# EasyEDA Pro project CH32V307_V6.0.0.eprj, board CH32V307
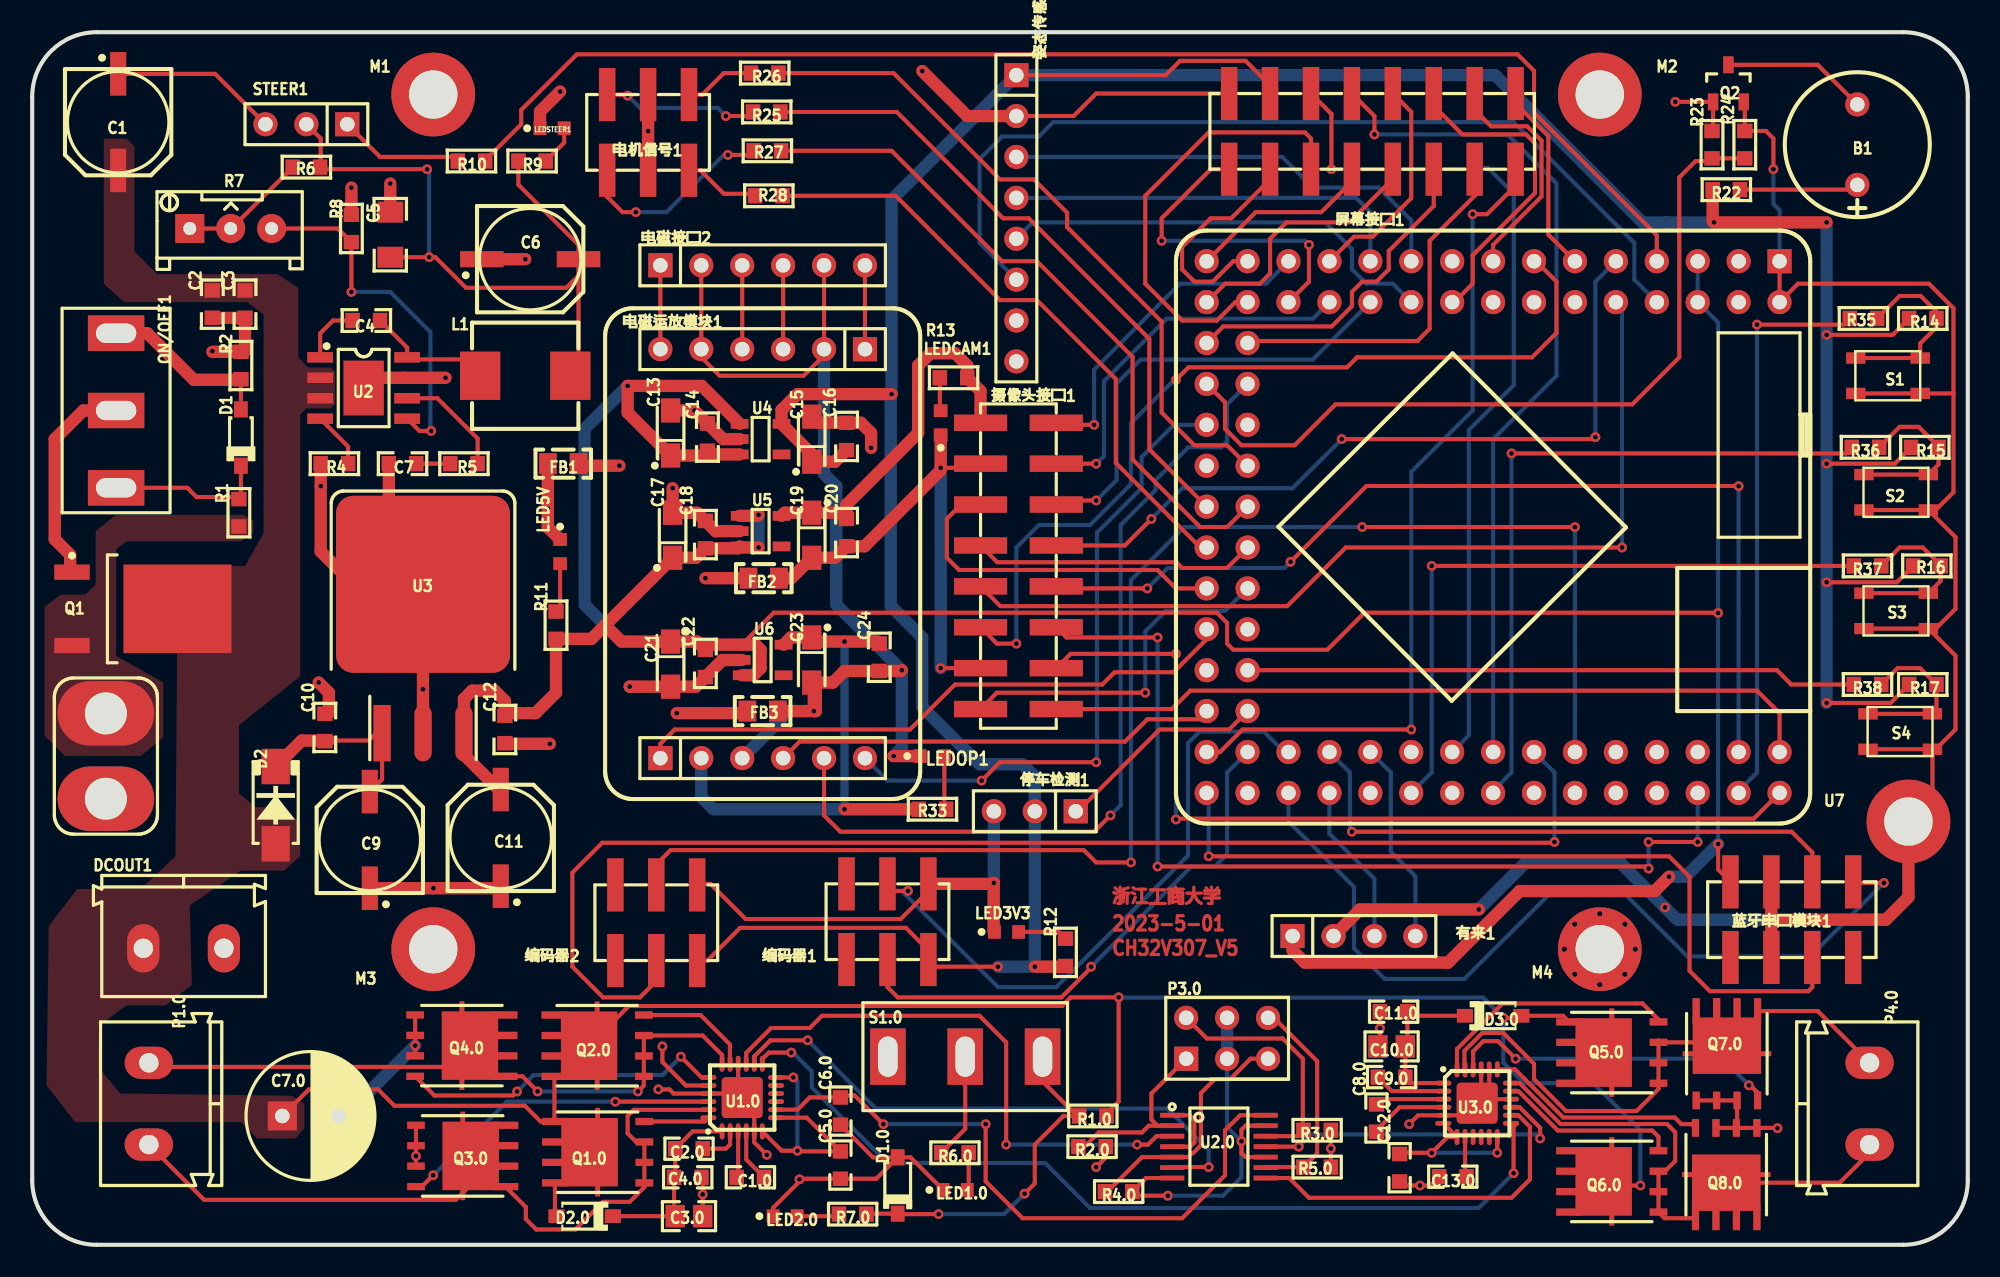
[diagram p1: board, top side]
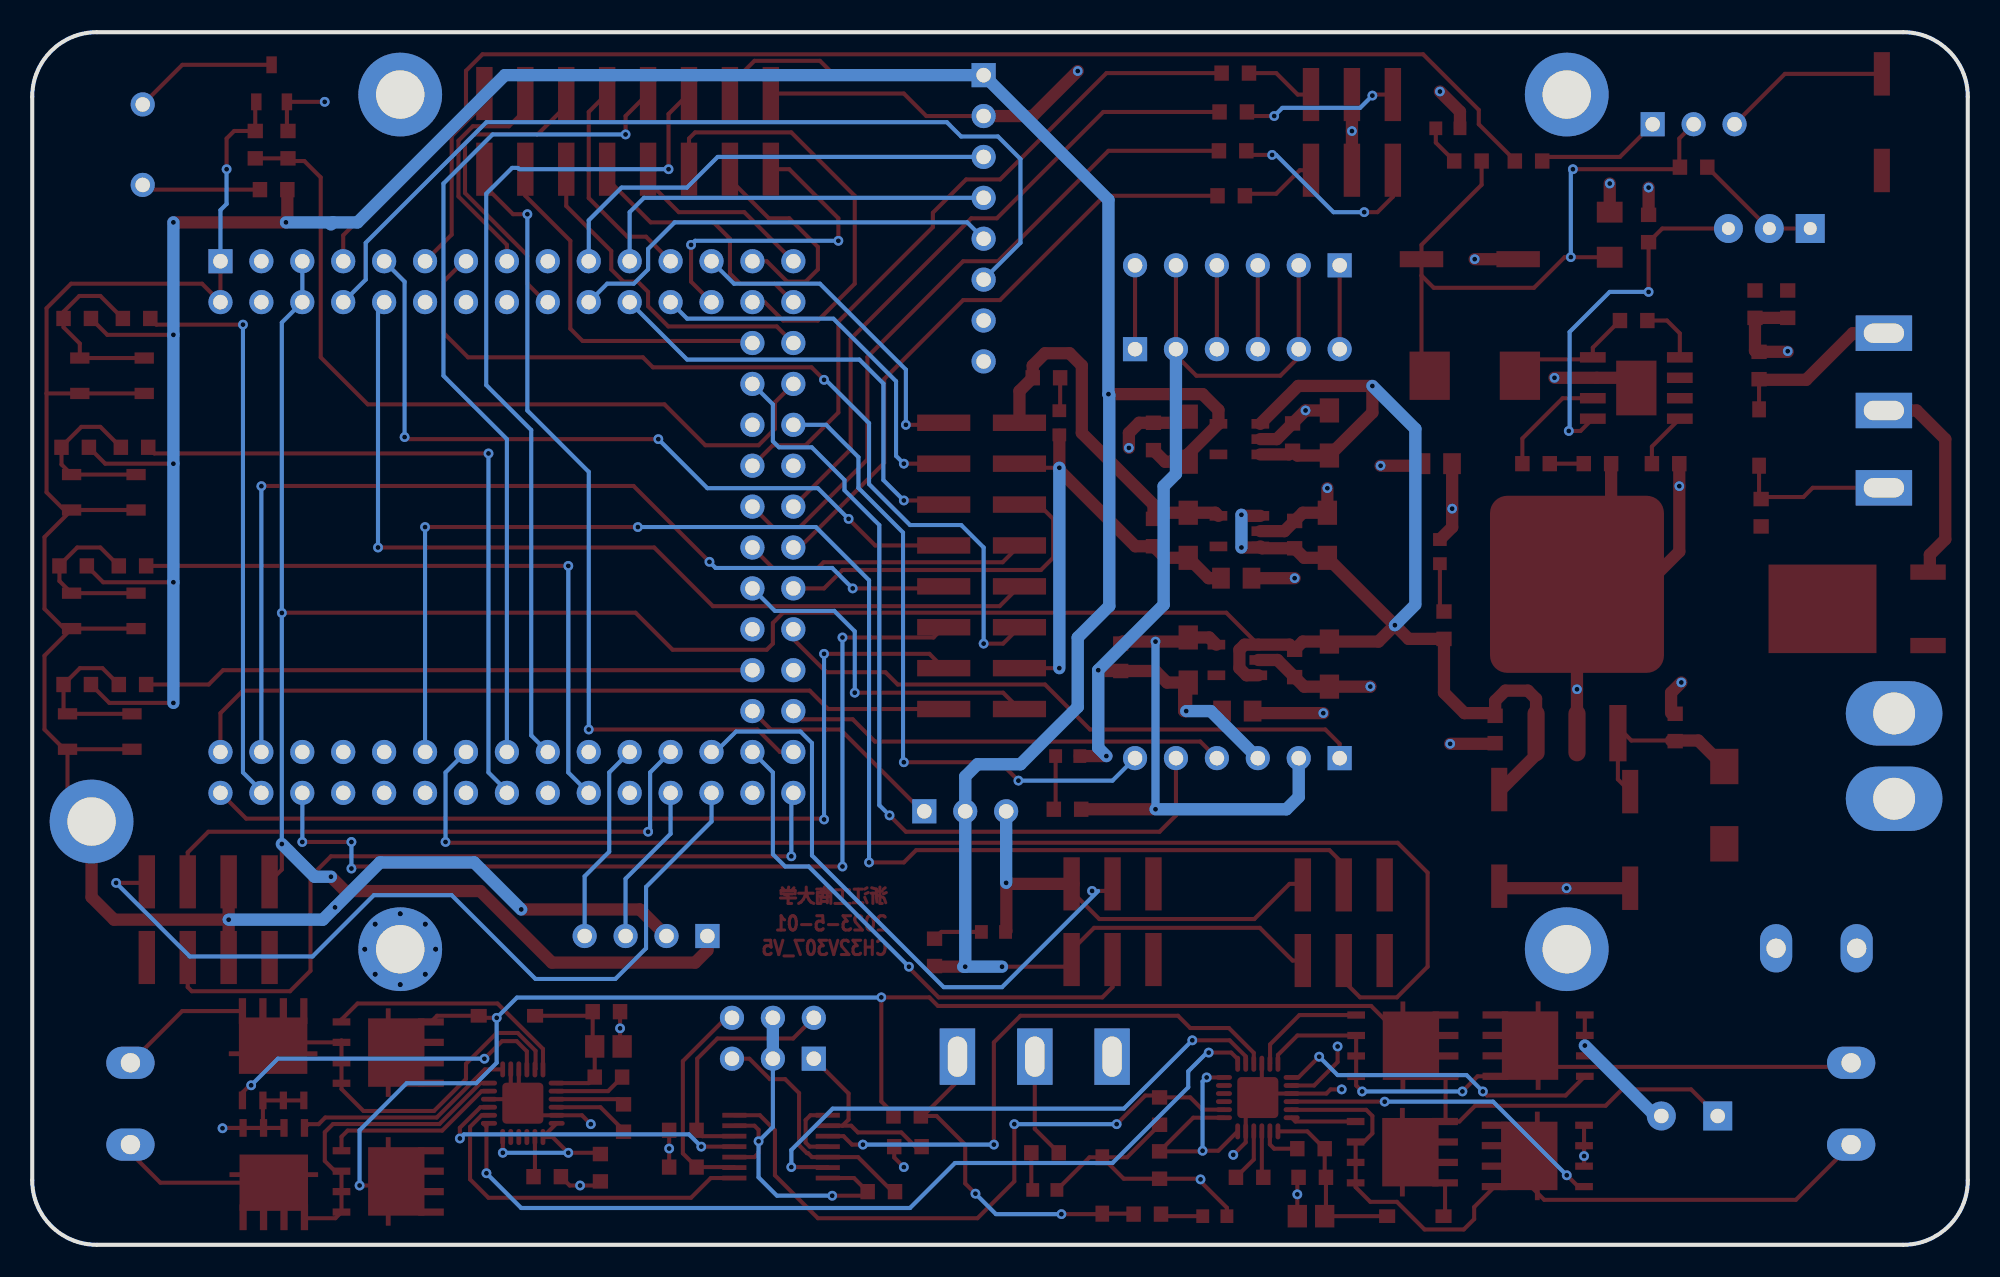
[diagram p2: board, bottom side, seen from below]

Outline 120.14 x 75.31 mm; copper layers: Top Layer, Bottom Layer. Coordinates in mm from the lower left corner of the outline.
Outline path: 0,71.31 0,4 arc(1.17,1.17) 4,0 116.14,0 arc(118.97,1.17) 120.14,4 120.14,71.31 arc(118.97,74.14) 116.14,75.31 4,75.31 arc(1.17,74.14) 0,71.31
Stack: Top Layer 0.035mm / Dielectric1 1.51mm FR4 er 4.5 / Bottom Layer 0.035mm

## Design rules (mm)
spacing safeClearance (default): track to track 0.152, other pairs 0.152 to 0.3
track width trackWidth (default): min 0.127, default 0.254, max 2.54
differential pair differentialPair (default): width min 0.127, default 0.254, max 2.54; gap min 0.152, default 0.152
via viaSize (default): diameter min 0.5, default 0.61, max 10; hole min 0.3, default 0.305, max 6

## Placement (name value [footprint] x y rotation side)
B1  BEEP  [BEEP 9x5.5mm]  113.28 68.33 90 top
C1  220uF  [CAPS6.3]  5.33 69.72 90 top
C1.0  100nF  [CAPC1608[0603]S-N]  44.58 4.19 180 top
C2  4.7nF  [CAPC1608[0603]S-N]  11.18 58.42 270 top
C2.0  1uF  [CAPC1608[0603]S-N]  40.77 5.97 180 top
C3  100nF  [CAPC1608[0603]S-N]  13.21 58.42 270 top
C3.0  10uF  [CAPC2012[0805]S-N]  40.77 1.78 0 top
C4  100nF  [CAPC1608[0603]S-N]  20.74 57.4 0 top
C4.0  100nF  [CAPC1608[0603]S-N]  40.69 4.19 0 top
C5  47uF  [CAPC3216[1206]S]  22.22 62.74 90 top
C5.0  1uF  [CAPC1608[0603]S-N]  50.17 4.95 90 top
C6  220uF  [CAPS6.3]  30.91 61.21 180 top
C6.0  1uF  [CAPC1608[0603]S-N]  50.17 8.3 90 top
C7  4.7nF  [CAPC1608[0603]S-N]  22.99 48.51 180 top
C7.0  220uF  [CAPPR3.5-8X11.5]  17.27 8 0 top
C8.0  100nF  [CAPC1608[0603]S-N]  83.44 7.87 90 top
C9  100uF  [CAPS6.3]  20.95 25.15 270 top
C9.0  1uF  [CAPC1608[0603]S-N]  84.38 10.41 0 top
C10  100nF  [CAPC1608[0603]S-N]  18.16 32.13 90 top
C10.0  10uF  [CAPC2012[0805]S-N]  84.38 12.32 180 top
C11  220uF  [CAPS6.3]  29.08 25.27 270 top
C11.0  100nF  [CAPC1608[0603]S-N]  84.5 14.48 180 top
C12  100nF  [CAPC1608[0603]S-N]  29.34 32 270 top
C12.0  1uF  [CAPC1608[0603]S-N]  84.87 4.79 90 top
C13  10uF  [CAPT3216]  39.62 50.42 90 top
C13.0  1uF  [CAPC1608[0603]S-N]  88.18 4.23 0 top
C14  100nF  [CAPC1608[0603]S-N]  41.91 50.17 90 top
C15  10uF  [CAPT3216]  48.39 50.04 90 top
C16  100nF  [CAPC1608[0603]S-N]  50.55 50.2 90 top
C17  10uF  [CAPT3216]  39.75 44.07 90 top
C18  100nF  [CAPC1608[0603]S-N]  41.78 44.11 90 top
C19  10uF  [CAPT3216]  48.39 44.07 270 top
C20  100nF  [CAPC1608[0603]S-N]  50.55 44.24 270 top
C21  10uF  [CAPT3216]  39.62 36.07 270 top
C22  100nF  [CAPC1608[0603]S-N]  41.78 36.11 270 top
C23  10uF  [CAPT3216]  48.39 36.32 270 top
C24  100nF  [CAPC1608[0603]S-N]  52.58 36.49 270 top
D1  BZT52C16  [SOD-123-L]  12.95 50.14 270 top
D1.0  BZT52C3V3  [SOD-123-L]  53.72 3.68 270 top
D2  SS54  [SMA[DO-214AC]]  15.11 27.31 90 top
D2.0  1N5819  [SOD-123-L]  34.29 1.78 0 top
D3.0  1N5819  [SOD-123-L]  90.68 14.22 180 top
DCOUT1  KF/WJ/DG 30x connecter  [KF/WJ/DG 301-2p-5.0mm#2]  9.4 18.42 0 top
FB1  0R  [INDC2012[0805]S]  32.96 48.51 0 top
FB2  0R  [INDC2012[0805]S]  45.41 41.4 0 top
FB3  0R  [INDC2012[0805]S]  45.34 33.15 0 top
L1  4.7uH  [0630 TPC 7*7*3]  30.6 53.98 0 top
LED1.0  Blue  [LEDC1608(0603)]  57.29 3.41 0 top
LED2.0  RED  [LEDC1608(0603)]  46.74 1.78 0 top
LED3V3  翠绿贴片LED  [LEDC1608(0603)]  60.48 19.43 0 top
LED5V  翠绿贴片LED  [LEDC1608(0603)]  32.77 43.05 270 top
LEDCAM1  翠绿贴片LED  [LEDC1608(0603)]  56.39 51.05 90 top
LEDOP1  翠绿贴片LED  [LEDC1608(0603)]  55.87 30.35 0 top
LEDSTEER1  翠绿贴片LED  [LEDC1608(0603)]  32.27 69.34 0 top
M1  MountHole  [M3-MountHole-Plated]  24.89 71.44 0 top
M2  MountHole  [M3-MountHole-Plated]  97.3 71.44 0 top
M3  MountHole  [M3-MountHole-Plated]  24.89 18.36 0 top
M4  MountHole  [M3-MountHole-Plated]  97.3 18.36 0 top
NOREF  -  [Pad_e1205]  116.46 26.29 0 top
ON/OFF1  SW-SPDT  [SS12D10]  5.21 51.82 90 top
P1.0  KF/WJ/DG 30x connecter  [KF/WJ/DG 301-2p-5.0mm]  7.24 8.76 270 top
P3.0  Header 3X2  [HDR2X3]  71.63 11.56 0 top
P4.0  KF/WJ/DG 30x connecter  [KF/WJ/DG 301-2p-5.0mm]  114.05 8.76 90 top
Q1  HY19P03  [TO-252AA]  5.74 39.5 0 top
Q1.0  TPH1R403NL  [DFN5x6]  35.1 5.75 90 top
Q2  S8050  [SOT-23]  105.28 72.14 90 top
Q2.0  TPH1R403NL  [DFN5x6]  35.06 12.36 90 top
Q3.0  TPH1R403NL  [DFN5x6]  26.72 5.52 270 top
Q4.0  TPH1R403NL  [DFN5x6]  26.67 12.37 270 top
Q5.0  TPH1R403NL  [DFN5x6]  98.04 11.94 90 top
Q6.0  TPH1R403NL  [DFN5x6]  98.04 3.94 90 top
Q7.0  TPH1R403NL  [DFN5x6]  105.19 11.87 0 top
Q8.0  TPH1R403NL  [DFN5x6]  105.15 4.36 180 top
R1  4.7K  [RESC1608[0603]S-N]  12.83 45.47 90 top
R1.0  2.2K  [RESC1608[0603]S-N]  65.83 8 180 top
R2  1K  [RESC1608[0603]S-N]  12.95 54.61 270 top
R2.0  10K  [RESC1608[0603]S-N]  65.79 6.1 0 top
R3.0  10K  [RESC1608[0603]S-N]  79.76 7.11 180 top
R4  200K  [RESC1608[0603]S-N]  18.76 48.51 180 top
R4.0  10K  [RESC1608[0603]S-N]  67.44 3.3 0 top
R5  20K  [RESC1608[0603]S-N]  26.8 48.51 180 top
R5.0  10K  [RESC1608[0603]S-N]  79.76 4.83 180 top
R6  15K  [RESC1608[0603]S-N]  17.02 66.93 180 top
R6.0  330R  [RESC1608[0603]S-N]  57.28 5.72 0 top
R7  10K  [RESPOT3296]  12.32 63.12 0 top
R7.0  1K  [RESC1608[0603]S-N]  50.93 1.91 180 top
R8  3.3K  [RESC1608[0603]S-N]  19.81 63.12 90 top
R9  10K  [RESC1608[0603]S-N]  31.03 67.31 180 top
R10  1K  [RESC1608[0603]S-N]  27.27 67.31 0 top
R11  4.7K  [RESC1608[0603]S-N]  32.51 38.48 90 top
R12  2.7K  [RESC1608[0603]S-N]  64.14 18.16 90 top
R13  2.7K  [RESC1608[0603]S-N]  57.19 53.85 180 top
R14  4.7K(DNP)  [RESC1608[0603]S-N]  117.35 57.53 0 top
R15  4.7K(DNP)  [RESC1608[0603]S-N]  117.48 49.53 0 top
R16  4.7K(DNP)  [RESC1608[0603]S-N]  117.6 42.16 0 top
R17  4.7K(DNP)  [RESC1608[0603]S-N]  117.35 34.8 0 top
R22  10R  [RESC1608[0603]S-N]  105.16 65.53 0 top
R23  4.7K  [RESC1608[0603]S-N]  104.27 68.33 90 top
R24  10K  [RESC1608[0603]S-N]  106.3 68.33 90 top
R25  100R  [RESC1608[0603]S-N]  45.59 70.36 0 top
R26  100R  [RESC1608[0603]S-N]  45.47 72.77 0 top
R27  100R  [RESC1608[0603]S-N]  45.63 67.95 0 top
R28  100R  [RESC1608[0603]S-N]  45.72 65.15 0 top
R33  2.7K  [RESC1608[0603]S-N]  55.88 27.05 0 top
R35  470R  [RESC1608[0603]S-N]  113.67 57.53 180 top
R36  470R  [RESC1608[0603]S-N]  113.79 49.53 180 top
R37  470R  [RESC1608[0603]S-N]  113.92 42.16 180 top
R38  470R  [RESC1608[0603]S-N]  113.92 34.8 180 top
S1  Button  [PTS810-3*4-CurvePin]  115.19 53.98 0 top
S1.0  SW-SPDT  [SS12D10]  57.91 11.68 0 top
S2  Button  [PTS810-3*4-CurvePin]  115.7 46.74 0 top
S3  Button  [PTS810-3*4-CurvePin]  115.7 39.37 0 top
S4  Button  [PTS810-3*4-CurvePin]  115.95 31.88 0 top
STEER1  Header 3  [HDR1X3]  19.56 69.6 180 top
U1  T型插头  [Wired T-Header ThroughHole]  4.57 30.35 0 top
U1.0  DRV8701E  [QFN24-4x4]  44.07 9.14 90 top
U2  SCT2450  [SOP-8E]  20.57 53.21 0 top
U2.0  SN74HC125PWR  [TSSOP-14]  73.66 6.1 0 top
U3  SPX2940-5.0  [TO-263-3]  24.26 36.4 0 top
U3.0  DRV8701E  [QFN24-4x4]  89.69 8.79 0 top
U4  RT9013-33  [SOT-23-5]  45.21 50.04 0 top
U5  RT9013-33  [SOT-23-5]  45.21 44.32 0 top
U6  RT9013-33  [SOT-23-5]  45.34 36.32 0 top
U7  -  [CH32V307VxT6_CoreBoard]  108.46 61.09 180 top
停车检测1  Header 3  [HDR1X3]  64.77 26.92 180 top
姿态传感器1  Header 8  [HDR1X8]  61.09 72.64 270 top
屏幕接口1  Header 8X2  [HDR2X8-M-SMT]  83.18 69.15 0 top
摄像头接口1  Header 8X2  [HDR2X8-M-SMT]  61.21 42.16 90 top
有来1  Header 4  [HDR1X4]  78.23 19.18 0 top
电机信号1  Header 3X2  [HDR2X3-M-SMT]  38.23 69.09 180 top
电磁接口2  Header 6  [HDR1X6]  38.99 60.83 0 top
电磁运放模块1  OPA_MOD  [SEEKFREE_4CHANEL_OPAMOD]  45.34 42.93 0 top
编码器1  Header 3X2  [HDR2X3-M-SMT]  53.09 20.07 180 top
编码器2  Header 3X2  [HDR2X3-M-SMT]  38.73 20 180 top
蓝牙串口模块1  Header 4X2  [Female-Header-2.54-SMD-8]  109.22 20.19 270 top

## Footprints (pads in the part's own frame, mm; a bottom-side part is the same pattern mirrored in y, then rotated)
0630 TPC 7*7*3
  rect 2.5x3 smd: 1(-2.8,0) 2(2.8,0)
BEEP 9x5.5mm
  round 1.5 hole 0.9: 1(-2.5,0) 2(2.5,0)
CAPC1608[0603]S-N
  rect 0.9x0.95 smd: 1(-0.85,0) 2(0.85,0)
CAPC2012[0805]S-N
  rect 1.2x1.4 smd: 1(-0.85,0) 2(0.85,0)
CAPC3216[1206]S
  rect 1.3x1.6 smd: 1(-1.4,0) 2(1.4,0)
CAPPR3.5-8X11.5
  rect 1.8x1.8 hole 0.9: 1(-1.75,0)
  round 1.8 hole 0.9: 2(1.75,0)
CAPS6.3
  rect 2.7x1 smd: 1(-3,0) 2(3,0)
CAPT3216
  rect 1.5x1.2 smd: 1(-1.4,0) 2(1.4,0)
CH32V307VxT6_CoreBoard
  rect 1.5x1.5 hole 0.9: 1(0,0)
  round 1.5 hole 0.9: 2(0,2.54) 3(2.54,0) 4(2.54,2.54) 5(5.08,0) 6(5.08,2.54) 7(7.62,0) 8(7.62,2.54) 9(10.16,0) 10(10.16,2.54) 11(12.7,0) 12(12.7,2.54) 13(15.24,0) 14(15.24,2.54) 15(17.78,0) 16(17.78,2.54) 17(20.32,0) 18(20.32,2.54) 19(22.86,0) 20(22.86,2.54) 21(25.4,0) 22(25.4,2.54) 23(27.94,0) 24(27.94,2.54) 25(30.48,0) 26(30.48,2.54) 27(33.02,0) 28(33.02,2.54) 29(35.56,0) 30(35.56,2.54) 31(35.56,5.08) 32(33.02,5.08) 33(35.56,7.62) 34(33.02,7.62) 35(35.56,10.16) 36(33.02,10.16) 37(35.56,12.7) 38(33.02,12.7) 39(35.56,15.24) 40(33.02,15.24) 41(35.56,17.78) 42(33.02,17.78) 43(35.56,20.32) 44(33.02,20.32) 45(35.56,22.86) 46(33.02,22.86) 47(35.56,25.4) 48(33.02,25.4) 49(35.56,27.94) 50(33.02,27.94) 51(35.56,33.02) 52(35.56,30.48) 53(33.02,33.02) 54(33.02,30.48) 55(30.48,33.02) 56(30.48,30.48) 57(27.94,33.02) 58(27.94,30.48) 59(25.4,33.02) 60(25.4,30.48) 61(22.86,33.02) 62(22.86,30.48) 63(20.32,33.02) 64(20.32,30.48) 65(17.78,33.02) 66(17.78,30.48) 67(15.24,33.02) 68(15.24,30.48) 69(12.7,33.02) 70(12.7,30.48) 71(10.16,33.02) 72(10.16,30.48) 73(7.62,33.02) 74(7.62,30.48) 75(5.08,33.02) 76(5.08,30.48) 77(2.54,33.02) 78(2.54,30.48) 79(0,33.02) 80(0,30.48)
DFN5x6
  rect 0.45x1.6 smd: 1(-1.905,2.65) 1(-0.635,2.65) 1(0.635,2.65) 1(1.905,2.65)
  rect 4.25x3.5 smd: 1(0,0.5)
  rect 5.5x0.3 smd: 1(0,0)
  rect 0.45x1.1 smd: 2(1.905,-2.9) 3(-1.905,-2.9) 3(-0.635,-2.9) 3(0.635,-2.9)
Female-Header-2.54-SMD-8
  rect 3.3x1.02 smd: 1(-2.35,3.81) 2(2.35,3.81) 3(-2.35,1.27) 4(2.35,1.27) 5(-2.35,-1.27) 6(2.35,-1.27) 7(-2.35,-3.81) 8(2.35,-3.81)
HDR1X3
  rect 1.5x1.5 hole 0.9: 1(0,0)
  round 1.5 hole 0.9: 2(2.54,0) 3(5.08,0)
HDR1X4
  rect 1.5x1.5 hole 0.9: 1(0,0)
  round 1.5 hole 0.9: 2(2.54,0) 3(5.08,0) 4(7.62,0)
HDR1X6
  rect 1.5x1.5 hole 0.9: 1(0,0)
  round 1.5 hole 0.9: 2(2.54,0) 3(5.08,0) 4(7.62,0) 5(10.16,0) 6(12.7,0)
HDR1X8
  rect 1.5x1.5 hole 0.9: 1(0,0)
  round 1.5 hole 0.9: 2(2.54,0) 3(5.08,0) 4(7.62,0) 5(10.16,0) 6(12.7,0) 7(15.24,0) 8(17.78,0)
HDR2X3
  rect 1.5x1.5 hole 0.9: 1(0,0)
  round 1.5 hole 0.9: 2(0,2.54) 3(2.54,0) 4(2.54,2.54) 5(5.08,0) 6(5.08,2.54)
HDR2X3-M-SMT
  rect 1.02x3.3 smd: 1(-2.54,-2.35) 2(-2.54,2.35) 3(0,-2.35) 4(0,2.35) 5(2.54,-2.35) 6(2.54,2.35)
HDR2X8-M-SMT
  rect 1.02x3.3 smd: 1(-8.89,-2.35) 2(-8.89,2.35) 3(-6.35,-2.35) 4(-6.35,2.35) 5(-3.81,-2.35) 6(-3.81,2.35) 7(-1.27,-2.35) 8(-1.27,2.35) 9(1.27,-2.35) 10(1.27,2.35) 11(3.81,-2.35) 12(3.81,2.35) 13(6.35,-2.35) 14(6.35,2.35) 15(8.89,-2.35) 16(8.89,2.35)
INDC2012[0805]S
  rect 1.1x1.3 smd: 1(-0.948,0) 2(0.948,0)
KF/WJ/DG 301-2p-5.0mm
  oval 2x3 hole 1.2: 1(2.54,0) 2(-2.54,0)
KF/WJ/DG 301-2p-5.0mm#2
  oval 2x3 hole 1.2: 1(2.5,0) 2(-2.5,0)
LEDC1608(0603)
  rect 0.8x0.85 smd: A(0.75,0) C(-0.75,0)
M3-MountHole-Plated
  round 5.2 hole 3: 1(0,0)
Pad_e1205
  round 5.2 hole 3: 1(0,0)
PTS810-3*4-CurvePin
  rect 1.2x0.7 smd: 1(-2,-1.1) 1(2,-1.1) 2(-2,1.1) 2(2,1.1)
QFN24-4x4
  rrect 2.55x2.55 smd: 0(0,0)
  oval 1x0.3 smd: 1(-2.1,1.25) 2(-2.1,0.75) 3(-2.1,0.25) 4(-2.1,-0.25) 5(-2.1,-0.75) 6(-2.1,-1.25) 13(2.1,-1.25) 14(2.1,-0.75) 15(2.1,-0.25) 16(2.1,0.25) 17(2.1,0.75) 18(2.1,1.25)
  oval 0.3x1 smd: 7(-1.25,-2.1) 8(-0.75,-2.1) 9(-0.25,-2.1) 10(0.25,-2.1) 11(0.75,-2.1) 12(1.25,-2.1) 19(1.25,2.1) 20(0.75,2.1) 21(0.25,2.1) 22(-0.25,2.1) 23(-0.75,2.1) 24(-1.25,2.1)
RESC1608[0603]S-N
  rect 0.9x0.95 smd: 1(-0.85,0) 2(0.85,0)
RESPOT3296
  rect 1.8x1.8 hole 0.8: 1(-2.54,0)
  round 1.8 hole 0.8: 2(2.54,0) ADJ(0,0)
SEEKFREE_4CHANEL_OPAMOD
  rect 1.5x1.5 hole 0.9: 1(6.35,12.7) 7(-6.35,-12.7)
  round 1.5 hole 0.9: 2(3.81,12.7) 3(1.27,12.7) 4(-1.27,12.7) 5(-3.81,12.7) 6(-6.35,12.7) 8(-3.81,-12.7) 9(-1.27,-12.7) 10(1.27,-12.7) 11(3.81,-12.7) 12(6.35,-12.7)
SMA[DO-214AC]
  rect 2.2x1.75 smd: A(-2.4,0) K(2.4,0)
SOD-123-L
  rect 1x0.85 smd: A(-1.75,0) K(1.75,0)
SOP-8E
  rect 2.5x3.4 smd: 0(0,0)
  rect 1.6x0.65 smd: 1(-2.7,1.905) 2(-2.7,0.635) 3(-2.7,-0.635) 4(-2.7,-1.905) 5(2.7,-1.905) 6(2.7,-0.635) 7(2.7,0.635) 8(2.7,1.905)
SOT-23
  rect 1.05x0.65 smd: 1(-1.15,0.95) 2(-1.15,-0.95) 3(1.15,0)
SOT-23-5
  rect 1.1x0.6 smd: 1(-1.3,0.95) 2(-1.3,0) 3(-1.3,-0.95) 4(1.3,-0.95) 5(1.3,0.95)
SS12D10
  rect 2.2x3.5 hole 1.2x2.5: 1(-4.8,0) 2(0,0) 3(4.8,0)
TO-252AA
  rect 6.7x5.5 smd: 1(3.275,0)
  rect 2.2x0.95 smd: 2(-3.275,2.28) 3(-3.275,-2.28)
TO-263-3
  rect 1.07x3.5 smd: 1(-2.54,-4.623)
  rrect 10.8x11 smd: 2(0,4.623)
  rrect 1.07x3.5 smd: 2(0,-4.623) 3(2.54,-4.623)
TSSOP-14
  rect 1.5x0.3 smd: 1(-2.9,1.95) 2(-2.9,1.3) 3(-2.9,0.65) 4(-2.9,0) 5(-2.9,-0.65) 6(-2.9,-1.3) 7(-2.9,-1.95) 8(2.9,-1.95) 9(2.9,-1.3) 10(2.9,-0.65) 11(2.9,0) 12(2.9,0.65) 13(2.9,1.3) 14(2.9,1.95)
Wired T-Header ThroughHole
  rrect 6x4 hole 2.6: 1(0,2.65) 2(0,-2.65)

## Nets
As in the schematic, except:
GND5V: C13.2 C14.2 C15.2 C16.2 C17.2 C18.2 C21.2 C22.2 FB1.2 FB2.1 FB3.1 LED3V3.C NOREF.1 Q2.2 R24.2 S1.1 S2.1 S3.1 S4.1 U4.2 U5.2 U6.2 U7.1 U7.2 停车检测1.3 姿态传感器1.2 屏幕接口1.2 有来1.2 编码器1.1 编码器2.1 蓝牙串口模块1.5 蓝牙串口模块1.6

Pads without a net: M1 1; M2 1; M3 1; M4 1; S1.0 1; U1.0 9 10 11; U3.0 9 10 11; U4 4; U5 4; U6 4; U7 3 4 12 14 16 17 36 37 46 47 53 59 62 63 67 69 71 72 73 74 76; 姿态传感器1 7 8; 编码器1 5 6; 编码器2 5 6; 蓝牙串口模块1 2 8

## Via types
v1: diameter 0.61, hole 0.305, Top Layer to Bottom Layer, 157 vias

## Routing (per net, layer and track width the routed paths; a pad name or vN(x,y) marks a point on that pad's centre or on a via; arc(x,y) is an arc through that point)
3V3: length 21.7
  Top Layer w0.254: R1.0.2 64.86,8 ; 64.86,8 62.71,10.15 S1.0.3 ; 64.86,8 64.01,8 62.23,6.22 62.23,3.81 v1(61.59,3.18) ; R7.0.1 51.8,1.93 D1.0.K 53.75,1.91 v1(56.26,1.91)
  Bottom Layer w0.254: v1(56.26,1.91) 60.33,1.91 v1(61.59,3.18)
DVDD: length 40.3
  Top Layer w0.254: U1.0.8 47.5,8.39 48.26,9.15 49.88,9.15 ; U2.0.14 74.98,8.05 74.04,7.11 74.04,4.32 71.37,1.65 61.47,1.65 59.18,3.94 v1(59.18,7.49) ; 49.89,9.14 49.88,9.15 ; 49.88,9.15 C6.0.2 50.28,9.27 51.05,9.27 v1(52.83,7.49)
  Bottom Layer w0.254: v1(59.18,7.49) v1(52.83,7.49)
GND5V: length 212.1
  Top Layer w0.254: S2.1 119.38,43.95 119.38,39.5 118.15,38.27 S3.1 ; S2.1 118.15,45.64 119.25,46.74 119.25,52.88 ; S2.1 S2.1 ; 姿态传感器1.2 64.64,70.1 66.04,71.5 屏幕接口1.2 ; U7.1 U7.2 109.6,59.69 117.73,59.69 119.25,58.17 119.25,52.88 ; Q2.2 106.3,70.92 R24.2 107.61,69.18 108.08,68.71 v1(108.08,66.8) ; S1.1 S1.1 119.25,52.88 ; 编码器1.1 55.63,21.95 53.91,20.23 44.28,20.23 42.1,22.42 41.34,22.42 编码器2.1 ; NOREF.1 117.95,27.78 S4.1 ; S4.1 S4.1 ; S4.1 118.15,30.78 119.38,32 119.38,36.59 S3.1 ; S3.1 S3.1
  Top Layer w0.762: FB3.1 44.26,33.02 v1(40,33.02) ; v1(55.24,72.9) 58.04,70.1 姿态传感器1.2 ; U5.2 42.42,44.32 C18.2 41.27,45.47 C17.2 v1(39.75,46.99) ; 蓝牙串口模块1.5 v1(107.95,20.19) ; v1(107.95,20.19) 115.06,20.19 116.46,21.59 NOREF.1 ; v1(107.95,20.19) 蓝牙串口模块1.6 ; 33.91,48.51 34.04,48.39 v1(36.45,48.39) ; 48.39,51.44 48.77,51.05 C16.2 51.43,51.05 52.07,50.42 v1(52.07,49.5) ; v1(89.79,20.83) 82.42,20.83 有来1.2 ; 59.68,22.47 59.63,22.42 编码器1.1 55.5,22.42 ; 59.68,22.47 59.68,19.48 LED3V3.C ; 59.68,22.47 v1(59.69,22.48) ; 44.04,36.32 42.85,36.32 C22.2 41.19,34.67 C21.2 37.09,34.67 v1(37.08,34.67) ; U4.2 42.89,50.04 C14.2 v1(41.11,51.82) 39.62,51.82 ; v1(41.78,41.4) FB2.1
  Bottom Layer w0.254: U7.1 108.46,64.26 108.08,64.64 v1(108.08,66.8)
  Bottom Layer w0.762: v1(89.79,20.83) 92.71,23.75 98.55,23.75 v1(101.35,20.96) 102.11,20.19 v1(107.95,20.19) ; v1(59.69,22.48) 停车检测1.3
GNDBAT: length 188
  Top Layer w0.254: Q7.0.3 Q7.0.3 Q7.0.3 ; v1(85.47,7.49) 86.02,8.04 88.94,8.04 U3.0.0 89.94,9.04 ; 84.87,3.68 v1(86.14,3.68) 86.78,3.68 C13.0.1 ; LED2.0.C 45.99,2.3 47.62,3.94 v1(47.62,4.06) 47.66,4.1 C5.0.1 52.39,4.1 D1.0.A ; C11.0.2 v1(83.65,13.45) 83.65,12.45 83.78,12.32 ; 43.82,9.39 44.82,8.39 U1.0.5 44.82,6.36 v1(45.59,5.59) ; 43.82,9.39 U1.0.16 ; 43.82,9.39 39.81,9.39 39.55,9.65 v1(38.86,9.65) ; Q8.0.3 105.82,7.3 105.82,8.84 ; Q8.0.3 Q8.0.3 108.33,7.26 ; Q8.0.3 Q8.0.3 ; C3.0.2 v1(41.62,3.13) 41.62,4.11 41.54,4.19 ; v1(66.04,4.83) 66.64,5.42 66.64,5.82 ; 23.77,13.13 23.77,12.63 ; U3.0.16 89.94,9.04 ; 89.94,9.04 90.44,9.54 U3.0.20 ; 89.94,9.04 U3.0.21 ; U2.0.1 71.84,8.05 72.14,7.75 72.14,6.35 71.88,6.1 U2.0.4 ; U2.0.7 69.13,4.15 R4.0.2 68.54,3.05 v1(70.48,3.05) ; C1.2 11.35,72.72 STEER1.3 ; C6.0.1 52.19,5.43 D1.0.A ; LED1.0.C 54.52,5.43 D1.0.A ; R3.0.1 v1(80.61,5.98) R5.0.1 ; 41.97,9.89 40.57,9.89 39.12,11.35 v1(39.12,12.32) ; U2.0.13 75.31,7.4 75.06,7.14 v1(75.06,6.43) 75.06,5.7 75.31,5.45 U2.0.10 ; v1(23.77,12.38) Q4.0.3 ; 23.77,13.26 Q4.0.3 ; Q3.0.3 v1(23.82,5.51) Q3.0.3 Q3.0.3
  Top Layer w0.762: U3.2 19.94,41.02 17.91,43.05 v1(17.91,47.12) R4.2 ; U3.2 22.14,43.14 C7.2 ; U3.2 v1(24.26,34.5) U3.2 ; v1(25.65,53.85) 21.21,53.85 U2.0 ; C2.2 C3.2 13.21,55.52 13.14,55.46 R2.1 11.18,55.46 ; v1(32.77,71.63) 31.52,70.38 LEDSTEER1.C ; 电机信号1.4 v1(38.23,69.17) 电机信号1.3 ; C12.2 29.38,31.12 v1(32.13,31.12) ; 29.08,22.15 v1(24.91,22.15) C9.2 ; v1(17.78,34.93) 18.41,34.29 18.41,33.02 ; LED5V.C 32,44.57 v1(32,45.72) 32,48.5 FB1.1 ; R8.2 v1(19.81,65.66) ; v1(22.22,65.91) 22.22,64.14 ; v1(30.61,61.21) C6.2
  Bottom Layer w0.254: v1(70.48,3.05) 73.91,3.05 75.06,4.19 v1(75.06,6.43) 74.17,7.32 74.17,11.21
  Bottom Layer w0.762: C7.0.2 19.4,8 v1(23.77,12.38) ; P3.0.4 P3.0.3 74.17,11.21
  vias: v1(11.18,55.5) v1(108.33,7.24)
GNDCAM: length 32.5
  Top Layer w0.254: 摄像头接口1.14 58.61,48.26 v1(56.39,48.26) ; v1(56.39,35.81) 摄像头接口1.4
  Top Layer w0.762: 46.36,41.4 47.12,41.4 C19.2 49.83,42.67 C20.2 51.67,43.39 56.39,48.1 v1(56.39,48.26) LEDCAM1.C
  Bottom Layer w0.762: v1(56.39,48.26) v1(56.39,35.81)
GNDOP: length 66.5
  Top Layer w0.254: 电磁接口2.2 41.53,55.12 42.67,53.98 47.88,53.98 49.02,55.12 49.15,55.12 电磁接口2.5
  Top Layer w0.762: v1(48.51,33.15) FB3.2 ; v1(48.51,33.15) 48.64,33.15 48.64,34.67 ; v1(48.51,33.15) 48.51,34.54 48.64,34.67 ; v1(53.47,30.35) LEDOP1.C ; v1(53.98,35.69) 53.93,35.64 C24.2 50.42,35.64 49.7,34.92 C23.2 48.64,34.67
  Bottom Layer w0.762: v1(53.47,30.35) 53.98,30.86 v1(53.98,35.69) 49.91,39.75 49.91,47.12 49.15,47.88 电磁运放模块1.2 ; 电磁运放模块1.9 46.99,33.15 v1(48.51,33.15)
VCC3V3: length 228.7
  Top Layer w0.254: 屏幕接口1.4 76.83,72.01 75.31,73.53 71.25,73.53 70.36,72.64 姿态传感器1.1 ; v1(111.38,33.66) 115.36,33.66 R17.1 ; v1(111.38,56.52) 115.48,56.52 R14.1 ; v1(111.38,41.15) 115.74,41.15 R16.1 ; v1(59.94,17.27) 56.07,17.27 编码器1.2 55.63,18.29 54.23,19.69 43.94,19.69 41.91,17.65 41.28,17.65 ; v1(111.38,48.51) 115.61,48.51 116.62,49.53
  Top Layer w0.762: R22.1 104.31,63.59 v1(104.39,63.5) v1(111.38,63.5) ; v1(62.23,17.27) 64.1,17.27 R12.1 ; C16.1 49.83,48.64 C15.1 48.39,49.11 U4.5 46.51,51.85 47.5,52.83 v1(53.34,52.83)
  Bottom Layer w0.762: v1(62.23,17.27) 停车检测1.2 62.23,29.08 61.47,29.85 58.8,29.85 55.24,33.4 55.24,37.72 53.29,39.68 53.29,52.78 v1(53.34,52.83) 53.34,64.9 姿态传感器1.1 90.8,72.64 99.95,63.5 101.47,63.5 ; v1(62.23,17.27) v1(59.94,17.27) ; v1(62.23,17.27) 62.36,17.27 ; 101.47,63.5 101.6,63.37 ; 101.47,63.5 v1(104.39,63.5) ; v1(111.38,63.5) v1(111.38,56.52) v1(111.38,48.51) v1(111.38,41.15) v1(111.38,33.66)
VCC5V: length 217.4
  Top Layer w0.254: v1(104.65,24.89) 104.65,23.31 蓝牙串口模块1.7 ; v1(104.65,39.24) 104.63,39.26 82.69,39.26 80.39,36.96 74.55,36.96 74.17,37.34 74.17,38.62 73.53,39.26 46.02,39.26 44.04,37.27
  Top Layer w0.762: 有来1.1 78.23,18.29 78.99,17.53 87.88,17.53 92.33,21.97 100.71,21.97 v1(101.6,22.86) ; v1(35.56,38.48) 36.58,37.47 C21.1 41.27,37.47 C22.1 42.1,37.27 44.89,37.27 45.21,36.95 45.21,35.81 44.77,35.37 44.04,35.37 ; v1(35.56,38.48) C17.1 41.19,42.67 C18.1 43.8,43.26 43.85,43.31 ; v1(35.56,38.48) 34.71,37.63 R11.1 32.51,34.29 31.24,33.02 29.5,33.02 C12.1 29.34,33.78 28.7,34.42 27.3,34.42 26.8,33.91 U3.3 26.8,30.43 29.08,28.15 ; U4.3 42.14,49.09 C14.1 41.61,49.02 C13.1 36.96,51.69 v1(36.96,53.34) 41.56,53.34 U4.1 ; v1(45.08,45.34) 45.02,45.27 U5.1 ; 43.85,43.31 U5.3 ; 43.85,43.31 v1(45.08,43.31)
  Bottom Layer w0.254: U7.5 U7.6 104.65,57.28 v1(104.65,39.24) v1(104.65,24.89)
  Bottom Layer w0.762: v1(45.08,45.34) v1(45.08,43.31) ; 34.29,39.88 34.29,50.67 v1(36.96,53.34) ; v1(35.56,38.48) 34.29,39.75 ; v1(104.65,24.89) 102.62,22.86 v1(101.6,22.86)
VCCBAT: length 112.4
  Top Layer w0.254: C7.0.1 17.17,9.65 21.46,9.65 22.48,8.64 30.58,8.64 31.56,7.66 Q1.0.1 32.41,7.69 Q2.0.1 ; R1.0.1 66.68,8.15 67.44,8.9 v1(67.44,15.37) 64.46,15.37 63.92,14.83 37.03,14.83 Q2.0.1 ; v1(99.82,3.68) 97.8,3.68 Q6.0.1 ; 32.54,2.03 32.45,2.13 Q1.0.1 ; v1(91.31,14.1) 92.3,14.1 D3.0.A 95.01,14.22 Q5.0.1
  Bottom Layer w0.254: v1(67.44,15.37) 67.45,15.35 90.06,15.35 v1(91.31,14.1) 91.31,11.3 92.58,10.03 96.9,10.03 99.82,7.11 v1(99.82,3.68)
VCCCAM: length 23.2
  Top Layer w0.762: 摄像头接口1.16 58.86,53.02 R13.1 58.04,54.61 57.28,55.37 55.75,55.37 54.99,54.61 54.99,50.42 50.55,45.97 C20.1 50.17,45.47 C19.1 46.7,45.47 U5.5
VCCOP: length 32.9
  Top Layer w0.762: v1(50.42,27.05) R33.1 ; C24.1 52.45,37.47 v1(50.42,37.47) 48.64,37.47 C23.1 47.09,37.72 U6.5
  Bottom Layer w0.508: v1(50.42,37.47) v1(50.42,27.05)
  Bottom Layer w0.762: 电磁运放模块1.8 41.53,27.81 42.29,27.05 v1(50.42,27.05)
VCCSTEER: length 43.1
  Top Layer w0.254: 33.91,60.2 33.91,54.48 L1.2 ; 33.91,60.2 33.15,59.44 26.92,59.44 25.02,61.34 v1(24.64,61.34) 24.63,61.34 C5.1 ; 33.91,60.2 C6.1 33.91,62.1 30.18,65.84 30.18,67.31 ; STEER1.2 17.91,68.71 17.91,66.97 R6.1 17.99,66.8 v1(24.51,66.8)
  Bottom Layer w0.254: v1(24.51,66.8) 24.64,66.68 v1(24.64,61.34)
(no net):
  vias: v1(95.1,18.36) v1(95.1,18.36) v1(95.74,19.91) v1(95.74,19.91) v1(95.74,16.8) v1(95.74,16.8) v1(97.3,20.56) v1(97.3,20.56) v1(97.3,16.16) v1(97.3,16.16) v1(98.86,19.91) v1(98.86,19.91) v1(98.86,16.8) v1(98.86,16.8) v1(99.5,18.36) v1(99.5,18.36)
A0: length 43.1
  Top Layer w0.254: R26.2 53.46,72.77 60.07,66.17 62.17,66.17 64.24,64.1 64.24,63.2 70.1,57.34 70.1,51.69 72.14,49.66 74.17,49.66 U7.38
A1: length 40.6
  Top Layer w0.254: R25.2 53.66,70.36 60.27,63.75 61.85,63.75 69.34,56.26 69.34,49.4 U7.39
A2: length 42.9
  Top Layer w0.254: R27.2 53.34,67.95 60.2,61.09 62.36,61.09 68.3,55.14 68.3,48.77 72.49,44.58 74.17,44.58 U7.40
A3: length 38.4
  Top Layer w0.254: U7.41 72.51,43.31 67.26,48.56 67.26,53.77 62.36,58.67 60.07,58.67 53.59,65.15 R28.2
A4: length 17.7
  Top Layer w0.254: 摄像头接口1.10 59.91,42.39 71.02,42.39 71.37,42.04 74.17,42.04 U7.42
A5: length 21.8
  Top Layer w0.254: 摄像头接口1.12 57.66,45.97 56.77,45.09 56.77,42.67 57.53,41.91 69.85,41.91 70.99,40.77 U7.43
A6: length 21.9
  Top Layer w0.254: v1(69.09,34.29) 59.88,34.29 摄像头接口1.2
  Bottom Layer w0.254: v1(69.09,34.29) 69.09,38.1 70.36,39.37 74.04,39.37 U7.44
A7: length 38.1
  Top Layer w0.254: 电磁运放模块1.7 38.99,31.12 39.88,32 54.48,32 57.28,34.8 66.42,34.8 67.18,35.56 70.84,35.56 72.9,37.61 U7.45
A8: length 35.5
  Top Layer w0.254: R35.2 112.43,57.15 v1(107.06,57.15)
  Bottom Layer w0.254: U7.77 105.92,28.19 107.06,29.34 v1(107.06,57.15)
A9: length 48.4
  Top Layer w0.254: U7.80 108.46,33.02 107.06,34.42 71.88,34.42 70.74,33.27 摄像头接口1.1
A10: length 56.2
  Top Layer w0.254: 摄像头接口1.3 64.45,36.7 v1(70.99,36.7) ; v1(70.99,26.42) 71.04,26.47 106.86,26.47 U7.79
  Bottom Layer w0.254: v1(70.99,26.42) v1(70.99,36.7)
A15: length 83.8
  Top Layer w0.254: U7.7 100.84,62.7 93.22,70.32 93.22,72.91 92.19,73.94 33.81,73.94 30.35,70.49 30.35,69.6 28.12,67.36 R10.2
B0: length 38
  Top Layer w0.254: U7.48 108.3,35.69 109.19,34.8 R38.2
B1: length 27.5
  Top Layer w0.254: 电磁运放模块1.10 47.64,31.26 67.83,31.26 69.21,32.64 72.39,32.64 U7.49
B2: length 13.2
  Top Layer w0.254: 停车检测1.1 64.9,26.92 69.98,32 74.3,32 U7.50
B3: length 28.7
  Bottom Layer w0.254: 姿态传感器1.3 77.6,67.56 79.5,65.66 83.57,65.66 85.6,63.63 U7.19
B4: length 27.7
  Bottom Layer w0.254: U7.20 84.45,59.69 82.8,59.69 81.92,60.58 81.92,61.85 80.26,63.5 62.1,63.5 姿态传感器1.5
B5: length 25.4
  Bottom Layer w0.254: 姿态传感器1.4 82.17,65.02 83.06,64.14 U7.21
B6: length 28.2
  Top Layer w0.254: v1(66.04,46.23) 63.82,46.23 摄像头接口1.11
  Bottom Layer w0.254: v1(66.04,46.23) 67.31,47.5 67.31,53.49 68.8,54.98 79.49,54.98 U7.22
B7: length 13.7
  Top Layer w0.254: 屏幕接口1.10 85.6,70.36 85.6,65.01 83.2,62.61 82.04,62.61 U7.23
B8: length 23.8
  Top Layer w0.254: v1(66.04,48.51) 摄像头接口1.13
  Bottom Layer w0.254: U7.24 79.49,57.52 70.41,57.52 66.52,53.63 66.52,49 v1(66.04,48.51)
B9: length 20.7
  Top Layer w0.254: v1(65.91,50.93) 63.69,50.93 摄像头接口1.15
  Bottom Layer w0.254: v1(65.91,50.93) 65.91,54.36 71.25,59.69 76.58,59.69 U7.25
B12: length 40.8
  Top Layer w0.254: v1(86.87,42.16) R37.2
  Bottom Layer w0.254: v1(86.87,42.16) 86.87,29.34 U7.61
B13: length 53.5
  Top Layer w0.254: 屏幕接口1.6 80.64,70.23 v1(80.64,66.8)
  Bottom Layer w0.254: U7.64 89.17,31.64 89.17,50.6 91.96,53.4 91.96,65.28 90.36,66.88 90,66.88 89.92,66.8 v1(80.64,66.8)
B15: length 52.6
  Top Layer w0.254: 81.92,71.5 83.31,70.11 v1(83.31,68.96)
  Bottom Layer w0.254: v1(83.31,68.96) 91.57,68.96 94.61,65.91 94.61,53.98 90.68,50.04 U7.66
C0: length 53.3
  Top Layer w0.254: 电磁运放模块1.11 49.15,26.67 50.17,25.65 65.91,25.65 v1(66.93,26.67)
  Bottom Layer w0.254: 67.18,26.92 67.56,27.31 67.56,44.7 69.72,46.86 69.72,47.5 71.75,49.53 73.79,49.53 74.17,49.91 74.17,52.2 U7.34
C1: length 40.4
  Top Layer w0.254: v1(66.04,29.97) 60.07,29.97 v1(58.93,28.83)
  Bottom Layer w0.254: v1(58.93,28.83) 53.09,28.83 电磁运放模块1.12 ; U7.35 70.87,50.93 68.86,48.92 68.86,47 66.09,44.24 66.09,30.02 v1(66.04,29.97)
C8: length 59.1
  Top Layer w0.254: v1(69.85,37.72) 64.2,37.72 摄像头接口1.5 ; v1(103.38,25.02) v1(100.33,25.02) ; v1(100.33,23.37) 100.2,23.5 v1(69.85,23.5)
  Bottom Layer w0.254: v1(100.33,23.37) v1(100.33,25.02) ; v1(69.85,37.72) v1(69.85,23.5) ; v1(103.38,25.02) U7.75
C9: length 61.6
  Top Layer w0.254: v1(105.92,47.12) 105.91,47.13 82.81,47.13 v1(78.11,42.42) ; v1(69.21,40.77) 63.69,40.77 摄像头接口1.7
  Bottom Layer w0.254: v1(78.11,42.42) 77.72,42.04 70.48,42.04 v1(69.21,40.77) ; v1(105.92,47.12) U7.78
C10: length 57.4
  Bottom Layer w0.254: U7.8 99.44,59.94 99.44,62.23 91.95,69.72 63.37,69.72 62.48,68.83 60.2,68.83 58.8,67.44 58.8,62.23 姿态传感器1.6
C11: length 47.7
  Top Layer w0.254: v1(97.03,50.17) 96.9,50.04 v1(81.28,50.04) ; v1(69.47,45.09) 67.82,43.43 摄像头接口1.9
  Bottom Layer w0.254: v1(97.03,50.17) 97.03,59.82 U7.9 ; v1(69.47,45.09) 71.37,46.99 78.23,46.99 v1(81.28,50.04)
C12: length 57.2
  Top Layer w0.254: v1(98.68,43.31) 81.53,43.31 77.89,39.66 60.09,39.66 摄像头接口1.8
  Bottom Layer w0.254: U7.10 98.68,58.17 v1(98.68,43.31)
C13: length 49.9
  Top Layer w0.254: U7.33 74.04,52.32 74.04,50.67 75.06,49.66 78.36,49.66 80.9,52.2 99.31,52.2 102.23,55.12 102.23,66.29 103.25,67.31 104.1,67.31 R23.1 R24.1
D0: length 11.9
  Top Layer w0.254: 92.08,71.5 92.08,70.89 94.11,68.86 94.11,62.74 U7.11
D2: length 55
  Top Layer w0.254: 摄像头接口1.6 59.88,37.34 v1(61.09,37.34) ; v1(70.99,53.72) 71.77,54.5 81.61,54.5 82.24,55.12 93.09,55.12 94.61,56.64 94.61,59.82 93.34,61.09 U7.13
  Bottom Layer w0.254: v1(61.09,37.34) 61.09,43.31 62.48,44.7 65.66,44.7 68.2,47.24 68.2,51.03 70.89,53.72 v1(70.99,53.72)
D4: length 14.7
  Top Layer w0.254: U7.15 90.68,62.1 93.68,65.11 93.68,68.58 92.79,69.47 90.55,69.47 89.53,70.49 屏幕接口1.14
D7: length 20.1
  Top Layer w0.254: 屏幕接口1.12 86.99,70.74 88.77,68.96 92.73,68.96 93.28,68.41 93.28,65.32 89.41,61.45 89.41,59.69 88.27,58.55 U7.18
D8: length 42.8
  Top Layer w0.254: R36.2 112.56,49.15 v1(91.82,49.15)
  Bottom Layer w0.254: v1(91.82,49.15) 91.82,29.34 90.68,28.19 U7.65
D9: length 81.4
  Top Layer w0.254: 编码器2.4 38.73,16.38 37.72,15.37 35.43,15.37 33.53,17.27 33.53,23.11 35.38,24.97 94.44,24.97 v1(94.49,25.02)
  Bottom Layer w0.254: v1(94.49,25.02) 94.49,29.34 U7.68
D11: length 91.8
  Top Layer w0.254: v1(68.2,23.75) 66.04,23.75 65.28,24.51 39.62,24.51 38.73,23.62 编码器2.3 ; v1(95.76,44.58) v1(82.55,44.58)
  Bottom Layer w0.254: v1(95.76,44.58) U7.70 ; v1(82.55,44.58) 71.5,44.58 68.2,41.28 v1(68.2,23.75)
E0: length 20.2
  Top Layer w0.254: v1(79.25,62.1) 79.25,59.82 U7.26 ; v1(70.1,62.36) 70.1,63.75 73.15,66.8 屏幕接口1.1
  Bottom Layer w0.254: v1(79.25,62.1) 78.99,62.36 v1(70.1,62.36)
E1: length 14.1
  Top Layer w0.254: U7.27 74.55,61.09 73.28,59.82 72.14,59.82 71.37,60.58 71.37,61.98 73.15,63.75 74.42,63.75 76.83,66.17 屏幕接口1.3
E2: length 27.2
  Top Layer w0.254: 屏幕接口1.5 79.37,68.71 78.99,69.09 73.02,69.09 69.09,65.15 69.09,59.69 71.37,57.4 73.53,57.4 74.68,58.55 U7.28
E3: length 11.8
  Top Layer w0.254: U7.29 75.95,64.14 80.01,64.14 81.92,66.04 81.92,66.8
E4: length 16.6
  Top Layer w0.254: 屏幕接口1.9 84.45,66.2 81.75,63.5 77.85,63.5 76.83,62.48 76.83,60.33 76.2,59.69 74.04,59.69 U7.30
E5: length 21.1
  Top Layer w0.254: U7.31 73.93,57.04 80.66,57.04 81.92,58.29 81.92,59.18 82.55,59.82 83.44,59.82 84.2,60.58 84.2,61.72 86.99,64.52 屏幕接口1.11
E6: length 22.7
  Top Layer w0.254: 屏幕接口1.13 89.53,65.15 86.74,62.36 86.74,56.9 85.98,56.13 75.56,56.13 U7.32
E7: length 51.3
  Top Layer w0.254: U7.52 73.73,30.61 75.12,32 v1(85.6,32) ; v1(89.41,64.01) 90.3,64.01 92.08,65.79 92.08,66.8
  Bottom Layer w0.254: v1(85.6,32) 85.6,48.01 89.41,51.82 v1(89.41,64.01)
E8: length 50.3
  Top Layer w0.254: v1(73.02,24.13) 101.6,24.13 102.87,22.86 102.87,17.02 104.14,15.75 110.24,15.75 110.49,16 蓝牙串口模块1.4
  Bottom Layer w0.254: v1(73.02,24.13) 73.02,27.94 U7.51
E9: length 33.7
  Top Layer w0.254: v1(65.72,17.27) 65.72,17.21 63.88,15.37 53.72,15.37 53.09,16 编码器1.4
  Bottom Layer w0.254: U7.54 74.17,29.34 74.17,24.26 73.41,23.5 71.95,23.5 v1(65.72,17.27)
E11: length 39.1
  Top Layer w0.254: 编码器1.3 53.52,21.98 v1(54.36,21.98)
  Bottom Layer w0.254: 53.98,21.97 59.94,16 63.56,16 71.74,24.18 71.74,31.16 72.46,31.88 76.45,31.88 77.72,30.61 U7.56
E12: length 52.6
  Top Layer w0.254: 蓝牙串口模块1.1 113.09,22.48 v1(114.93,22.48)
  Bottom Layer w0.254: v1(114.93,22.48) 110.36,17.91 102.74,17.91 98.93,21.72 94.11,21.72 88.9,16.51 83.95,16.51 82.04,18.42 82.04,22.23 77.98,26.29 U7.55
E13: length 36.5
  Top Layer w0.254: v1(81.92,25.65) 109.21,25.65 110.49,24.37 蓝牙串口模块1.3
  Bottom Layer w0.254: v1(81.92,25.65) 81.79,25.78 81.79,29.34 U7.58
E14: length 10.6
  Bottom Layer w0.254: 80.9,27.69 U7.57 80.52,25.53 83.31,22.73 有来1.3
E15: length 12.6
  Bottom Layer w0.254: U7.60 84.33,29.34 84.33,24.41 85.85,22.89 有来1.4
L_A: length 45.2
  Top Layer w0.254: Q3.0.1 27.09,5.39 27.09,3.6 26.29,2.79 10.67,2.79 P1.0.1 ; 41.97,8.39 41.96,8.38 37.34,8.38 36.96,8 36.96,6.92 37.49,6.39 Q1.0.3 Q1.0.3 Q1.0.3 38,3.58 37.08,2.67 35.43,2.67 33.72,0.95 31.28,0.95 30.64,1.6 30.64,2.34 Q3.0.1
L_B: length 38.8
  Top Layer w0.254: P1.0.2 7.49,11.05 25.85,11.05 Q4.0.1 ; U1.0.18 42.82,11.79 41.61,13 Q2.0.3 Q2.0.3 Q2.0.3 37.96,9.9 v1(37.59,9.53) ; v1(31.37,9.53) 30.43,10.46 Q4.0.1
  Bottom Layer w0.254: v1(31.37,9.53) v1(37.59,9.53)
L_EN: length 35.2
  Top Layer w0.254: v1(48.13,12.7) 45.82,12.7 44.82,11.7 U1.0.14 ; v1(73.02,4.83) 70.79,4.83 U2.0.6
  Bottom Layer w0.254: v1(73.02,4.83) 73.02,5.89 70.45,8.46 52.37,8.46 v1(48.13,12.7)
L_EN_IN: length 15.4
  Top Layer w0.254: P3.0.5 75.62,11.56 74.35,10.29 73.41,10.29 72.54,9.42 72.54,6.18 72.05,5.69 71.98,5.69 71.74,5.45 U2.0.5 68.88,5.45 66.74,3.3 R4.0.1
L_PH: length 35.3
  Top Layer w0.254: v1(60.45,6.22) 60.45,12.57 58.8,14.22 49.02,14.22 48.26,13.46 45.86,13.46 44.32,11.92 U1.0.15 ; v1(68.58,6.22) 69.26,6.22 69.78,6.75 U2.0.3
  Bottom Layer w0.254: v1(60.45,6.22) v1(68.58,6.22)
L_PH_IN: length 11.6
  Top Layer w0.254: U2.0.2 69.85,7.4 ; 69.85,7.4 69.47,7.78 69.47,9.4 P3.0.1 ; 69.85,7.4 69.3,7.4 68.89,6.98 66.2,6.98 65.32,6.1 R2.0.1
NSLEEP: length 56.1
  Top Layer w0.254: v1(47.12,11.94) 45.72,11.94 45.32,11.54 U1.0.13 ; v1(91.95,4.45) 91.95,7.34 92.15,7.54 U3.0.13
  Bottom Layer w0.254: v1(47.12,11.94) 47.22,11.94 48.39,10.77 48.39,9.78 53.09,5.08 62.86,5.08 65.66,2.29 89.79,2.29 v1(91.95,4.45)
R_A: length 32.2
  Top Layer w0.254: U3.0.23 88.9,10.93 88.9,12.05 90.01,13.16 91.3,13.16 93.22,11.24 93.22,10.3 95.2,8.31 99.58,8.31 100.94,9.67 Q5.0.3 ; Q5.0.3 100.94,10.29 ; Q5.0.3 104.98,12.57 Q7.0.1 ; Q5.0.3 100.94,12.7 ; Q7.0.1 110.83,14.52 P4.0.1
R_B: length 29.7
  Top Layer w0.254: Q8.0.1 103.19,1.65 101.33,1.65 Q6.0.3 Q6.0.3 Q6.0.3 101.35,4.57 101.98,5.21 101.98,6.99 101.47,7.5 94.86,7.5 92.32,10.04 U3.0.18 ; Q8.0.1 112.19,3.86 114.05,5.72 P4.0.2
R_EN: length 22.1
  Top Layer w0.254: U2.0.8 78.02,4.15 79.25,2.92 91.82,2.92 92.96,4.06 92.96,7.33 92.25,8.04 U3.0.14
R_EN_IN: length 13.5
  Top Layer w0.254: P3.0.6 77.07,14.1 79.76,11.41 79.76,5.68 R5.0.2 76.59,4.83 U2.0.9
R_PH: length 20.5
  Top Layer w0.254: U3.0.15 92.32,8.54 93.6,7.27 v1(93.6,6.6) ; v1(78.61,6.1) U2.0.11
  Bottom Layer w0.254: v1(78.61,6.1) 79.37,6.86 93.34,6.86 v1(93.6,6.6)
R_PH_IN: length 15.2
  Top Layer w0.254: P3.0.2 72.91,12.81 77.61,12.81 78.87,11.56 78.87,7.15 R3.0.2 78.54,6.75 U2.0.12
$1N1675: length 10.8
  Top Layer w0.254: R2.2 D1.A
  Top Layer w0.762: R2.2 12.91,53.72 10.03,53.72 7.14,56.62 ON/OFF1.3
$1N1680: length 10.1
  Top Layer w0.254: 12.95,46.44 10.2,46.44 9.63,47.02 ON/OFF1.1 ; 12.95,46.44 D1.K ; 12.95,46.44 R1.2
$1N4031: length 3.1
  Top Layer w0.254: LED3V3.A 63.71,19.43 R12.2
$1N14893: length 2.1
  Top Layer w0.254: R13.2 56.34,51.85 LEDCAM1.A
$1N15943: length 11.6
  Top Layer w0.254: 18.41,31.32 20.88,31.32 21.34,31.78 U3.1 21.72,28.91 C9.1 ; 18.16,31.32 18.03,31.19
  Top Layer w0.762: D2.K 16.73,31.32 18.41,31.32
$1N17858: length 3.1
  Top Layer w0.254: LED5V.A 32.77,39.59 R11.2
$1N22991: length 3.3
  Top Layer w0.254: LEDOP1.A 56.62,27.16 R33.2
$1N30175: length 13.6
  Top Layer w0.254: ON/OFF1.2 4.95,51.56
  Top Layer w0.762: ON/OFF1.2 3.17,51.82 1.4,50.04 1.4,43.82 2.35,42.86 2.35,41.89 2.47,41.78
$1N38666: length 3.5
  Top Layer w0.254: 19.61,48.51 19.61,49.58 U2.4
$1N39173: length 3.8
  Top Layer w0.254: C4.1 18.67,57.4 17.87,56.61 U2.1
$1N39467: length 8
  Top Layer w0.254: C4.2 23.27,55.72 U2.8 23.4,54.99 26.78,54.99 L1.1
$1N41387: length 8
  Top Layer w0.254: 9.78,63.12 R7.ADJ 12.36,63.12 R6.2
$1N41664: length 7
  Top Layer w0.254: R5.1 27.65,50.08 25.15,52.58 U2.6
$1N41948: length 2.1
  Top Layer w0.254: R5.2 C7.1
$1N42725: length 22.3
  Top Layer w0.254: v1(24.77,50.55) 24.04,50.55 U2.5 ; R7.2 18.96,63.12 R8.1 v1(19.81,59.18)
  Bottom Layer w0.254: v1(19.81,59.18) 22.22,59.18 24.71,56.69 24.71,50.6 v1(24.77,50.55)
$1N43649: length 2.5
  Top Layer w0.254: LEDSTEER1.A 33.02,68.45 R9.1
$1N45499: length 7.8
  Top Layer w0.254: R10.1 26.16,67.56 21.59,67.56 STEER1.1
$1N56324: length 12
  Top Layer w0.254: S1.2 S1.2 117.19,55.98 118.2,56.98 R14.2 118.2,57.95 117.22,58.93 115.91,58.93 R35.1
$1N56387: length 10.7
  Top Layer w0.254: R36.1 115.91,50.8 117.09,50.8 118.33,49.57 R15.2 118.33,48.46 S2.2 S2.2
$1N56450: length 10.7
  Top Layer w0.254: S3.2 S3.2 118.45,41.23 R16.2 118.45,42.2 117.35,43.31 115.91,43.31 R37.1
$1N56513: length 10.2
  Top Layer w0.254: R38.1 115.78,35.81 117.18,35.81 R17.2 118.2,33.22 S4.2 S4.2
$1N101481: length 7.4
  Top Layer w0.254: B1.1 112.99,65.53 R22.2
$1N101720: length 9
  Top Layer w0.254: B1.2 110.82,73.29 Q2.3
$1N102266: length 4.2
  Top Layer w0.254: v1(101.99,70.99) 104.33,70.99 104.33,69.24 R23.2
$1N103802: length 9.8
  Top Layer w0.254: v1(36.96,71.37) 36.96,71.44 35.69,71.44 ; R25.1 44.49,70.1 v1(43.05,70.1)
  Bottom Layer w0.254: v1(43.05,70.1) 42.55,70.61 37.72,70.61 v1(36.96,71.37)
$1N103804: length 4.4
  Top Layer w0.254: R26.1 42.93,72.77 41.59,71.44 电机信号1.1
$1N103886: length 12.7
  Top Layer w0.254: 35.69,66.74 35.69,65.09 36.64,64.14 v1(37.46,64.14) ; v1(43.18,67.69) 44.53,67.69 R27.1
  Bottom Layer w0.254: v1(43.18,67.69) 42.93,67.69 39.37,64.14 v1(37.46,64.14)
$1N103888: length 4.8
  Top Layer w0.254: 电机信号1.2 41.47,66.74 42.93,65.28 44.74,65.28 R28.1
$1N112323: length 5.7
  Top Layer w0.254: 51.69,55.12 电磁接口2.6
$1N112483: length 5.7
  Top Layer w0.254: 46.61,55.12 电磁接口2.4
$1N112563: length 5.7
  Top Layer w0.254: 44.07,55.12 电磁接口2.3
$1N112723: length 5.7
  Top Layer w0.254: 电磁接口2.1 38.99,55.12
$1N192022: length 16
  Top Layer w0.254: U1.0.7 48.07,7.89 C5.0.2 47.54,5.8 v1(47.5,5.84) 46.52,5.84 U1.0.6 ; U1.0.12 v1(47.24,10.39)
  Bottom Layer w0.254: v1(47.5,5.84) 47.5,10.14 v1(47.24,10.39)
$1N192131: length 3.3
  Top Layer w0.254: U1.0.4 44.32,5.3 45.43,4.19
$1N192135: length 2.9
  Top Layer w0.254: C1.0.2 43.82,4.28 U1.0.3
$1N192141: length 2.6
  Top Layer w0.254: U1.0.2 43.32,6.24 43.05,5.97 C2.0.1
$1N192601: length 4.1
  Top Layer w0.254: 41.97,7.89 41.73,7.66 Q1.0.2
$1N192646: length 20.3
  Top Layer w0.254: Q3.0.2 24.18,3.61 24.88,4.32 v1(24.89,4.32) ; 41.97,8.89 36.2,8.89 v1(36.19,8.89)
  Bottom Layer w0.254: v1(36.19,8.89) 29.46,8.89 v1(24.89,4.32)
$1N192934: length 20.2
  Top Layer w0.254: Q4.0.2 24.96,9.27 29.84,9.27 v1(30.1,9.53) ; 41.97,10.39 41.55,10.39 v1(40.26,11.68)
  Bottom Layer w0.254: v1(30.1,9.53) 31.11,10.54 39.12,10.54 v1(40.26,11.68)
$1N192948: length 7.3
  Top Layer w0.254: Q2.0.2 41.48,14.27 43.31,12.45 43.31,11.26 U1.0.17
$1N193539: length 2.6
  Top Layer w0.254: 50.08,1.78 LED2.0.A
$1N193933: length 2.3
  Top Layer w0.254: LED1.0.A 58.13,3.5 R6.0.2
$1N193988: length 6.6
  Top Layer w0.254: S1.0.2 57.91,7.2 R6.0.1
$1N194595: length 2.5
  Top Layer w0.254: C13.0.2 88.94,4.32 U3.0.8
$1N194600: length 10.2
  Top Layer w0.254: C12.0.2 84.95,5.72 v1(86.87,5.72) 87.85,6.69 U3.0.7 87.59,7.54 ; v1(90.93,5.72) 90.93,6.69 U3.0.12
  Bottom Layer w0.254: v1(90.93,5.72) v1(86.87,5.72)
$1N194608: length 4.8
  Top Layer w0.254: C8.0.1 83.44,7.11 84.87,8.54 87.59,8.54
$1N194614: length 4.4
  Top Layer w0.254: C9.0.1 84.4,9.54 87.59,9.54
$1N194620: length 10.3
  Top Layer w0.254: 87.59,10.04 85.6,10.04 C9.0.2 C10.0.1 85.35,12.45 C11.0.1 85.61,14.22 D3.0.K
$1N194642: length 15.5
  Top Layer w0.254: U3.0.24 88.44,12.16 91.26,14.99 99.95,14.99 100.94,13.99 Q5.0.2
$1N194645: length 20.8
  Top Layer w0.254: v1(106.55,9.91) 106.64,9.91 107.09,9.45 Q7.0.2 ; v1(92.08,11.56) 90.98,12.65 90.07,12.65 89.44,12.01 U3.0.22
  Bottom Layer w0.254: v1(92.08,11.56) 104.9,11.56 v1(106.55,9.91)
$1N194668: length 13.8
  Top Layer w0.254: Q8.0.2 103.01,7.49 102.36,7.49 101.95,7.91 95.03,7.91 92.05,10.89 U3.0.19
$1N194674: length 11.2
  Top Layer w0.254: U3.0.17 92.25,9.54 94.7,7.09 100.56,7.09 100.94,6.71 Q6.0.2
$1N196227: length 4.3
  Top Layer w0.254: 87.59,9.04 83.76,9.04 C8.0.2
$1N196231: length 11.2
  Top Layer w0.254: U1.0.1 40.99,7.04 C2.0.2 39.92,4.27 C4.0.1 39.84,1.86 C3.0.1 36.29,1.78

## Copper pours and planes (outline as drawn; the poured copper is in the pictures)
GND5V on Bottom Layer: 132.21,77.22 269.75,77.22 269.75,-11.05 132.21,-11.05
GNDBAT on Top Layer: -165.23,89.03 -27.69,89.03 -27.69,-2.16 -165.23,-2.16
VCCBAT on Top Layer: 0.89,68.71 18.8,68.71 18.8,6.6 0.89,6.6
$1N1646 on Top Layer: 0.76,45.34 13.72,45.34 13.72,30.35 0.76,30.35

## Text on the board
Top Layer: 2023-5-01 | CH32V307_V5 | 浙江工商大学
Top Silkscreen Layer: LEDOP1
